# EAGLE schematic arduino-configuration-shield (EAGLE 6.5.0)
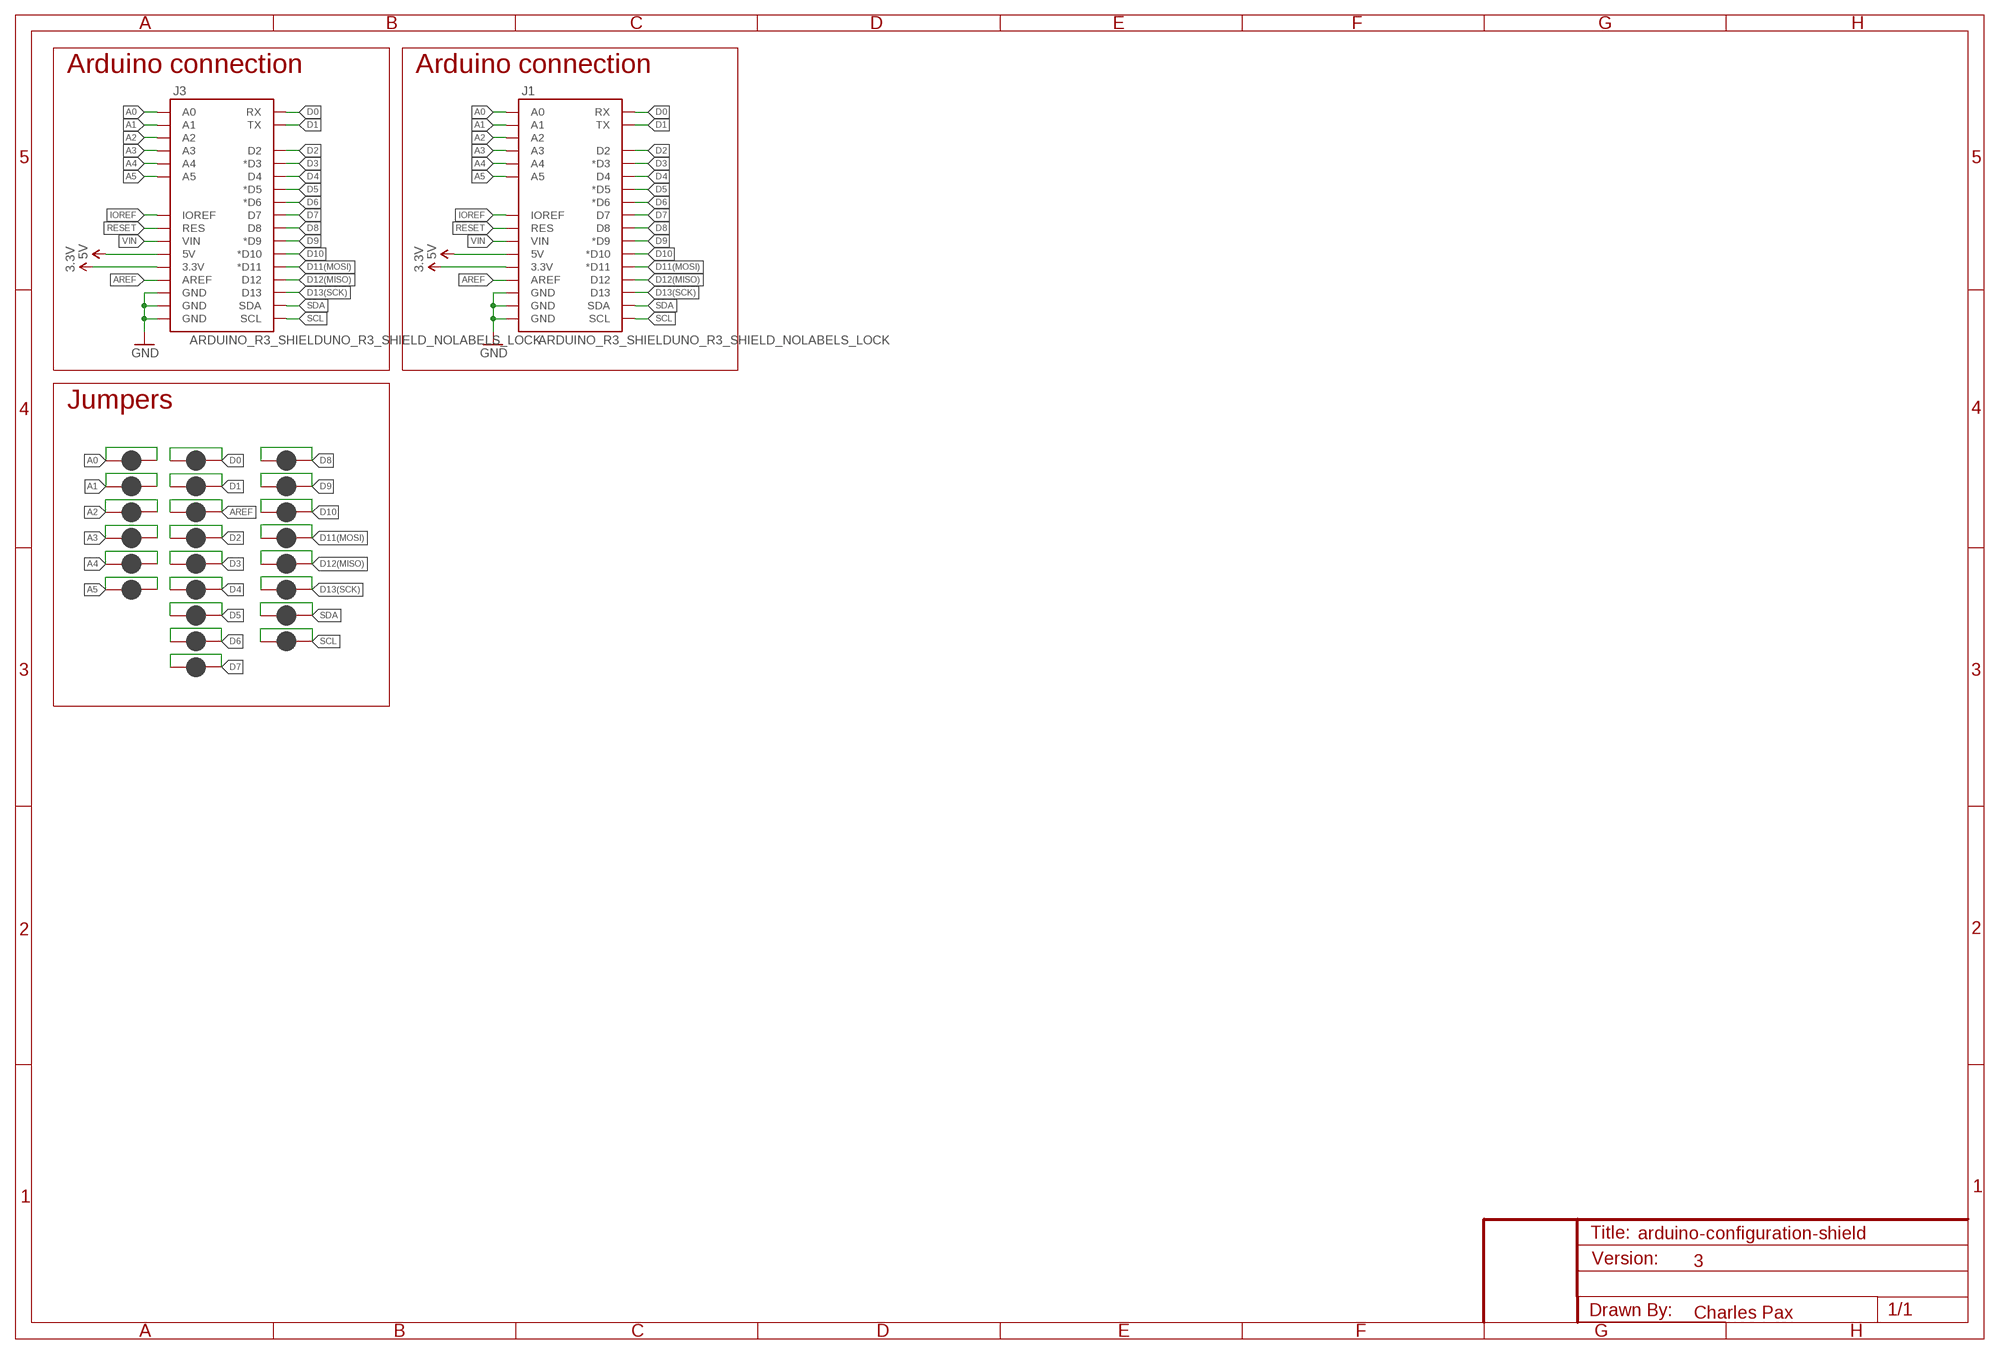
[diagram p0: schematic, sheet 1]

## Parts
J1  ARDUINO_R3_SHIELDUNO_R3_SHIELD_NOLABELS_LOCK  [UNO_R3_SHIELD_NOLABELS_LOCK]
J3  ARDUINO_R3_SHIELDUNO_R3_SHIELD_NOLABELS_LOCK  [UNO_R3_SHIELD_NOLABELS_LOCK]
SJ1  JUMPER-PAD-2-NC_BY_PASTE  [PAD-JUMPER-2-NC_BY_PASTE_YES_SILK]
SJ2  JUMPER-PAD-2-NC_BY_PASTE  [PAD-JUMPER-2-NC_BY_PASTE_YES_SILK]
SJ3  JUMPER-PAD-2-NC_BY_PASTE  [PAD-JUMPER-2-NC_BY_PASTE_YES_SILK]
SJ4  JUMPER-PAD-2-NC_BY_PASTE  [PAD-JUMPER-2-NC_BY_PASTE_YES_SILK]
SJ5  JUMPER-PAD-2-NC_BY_PASTE  [PAD-JUMPER-2-NC_BY_PASTE_YES_SILK]
SJ6  JUMPER-PAD-2-NC_BY_PASTE  [PAD-JUMPER-2-NC_BY_PASTE_YES_SILK]
SJ7  JUMPER-PAD-2-NC_BY_PASTE  [PAD-JUMPER-2-NC_BY_PASTE_YES_SILK]
SJ8  JUMPER-PAD-2-NC_BY_PASTE  [PAD-JUMPER-2-NC_BY_PASTE_YES_SILK]
SJ9  JUMPER-PAD-2-NC_BY_PASTE  [PAD-JUMPER-2-NC_BY_PASTE_YES_SILK]
SJ10  JUMPER-PAD-2-NC_BY_PASTE  [PAD-JUMPER-2-NC_BY_PASTE_YES_SILK]
SJ11  JUMPER-PAD-2-NC_BY_PASTE  [PAD-JUMPER-2-NC_BY_PASTE_YES_SILK]
SJ12  JUMPER-PAD-2-NC_BY_PASTE  [PAD-JUMPER-2-NC_BY_PASTE_YES_SILK]
SJ13  JUMPER-PAD-2-NC_BY_PASTE  [PAD-JUMPER-2-NC_BY_PASTE_YES_SILK]
SJ14  JUMPER-PAD-2-NC_BY_PASTE  [PAD-JUMPER-2-NC_BY_PASTE_YES_SILK]
SJ15  JUMPER-PAD-2-NC_BY_PASTE  [PAD-JUMPER-2-NC_BY_PASTE_YES_SILK]
SJ19  JUMPER-PAD-2-NC_BY_PASTE  [PAD-JUMPER-2-NC_BY_PASTE_YES_SILK]
SJ20  JUMPER-PAD-2-NC_BY_PASTE  [PAD-JUMPER-2-NC_BY_PASTE_YES_SILK]
SJ21  JUMPER-PAD-2-NC_BY_PASTE  [PAD-JUMPER-2-NC_BY_PASTE_YES_SILK]
SJ22  JUMPER-PAD-2-NC_BY_PASTE  [PAD-JUMPER-2-NC_BY_PASTE_YES_SILK]
SJ23  JUMPER-PAD-2-NC_BY_PASTE  [PAD-JUMPER-2-NC_BY_PASTE_YES_SILK]
SJ24  JUMPER-PAD-2-NC_BY_PASTE  [PAD-JUMPER-2-NC_BY_PASTE_YES_SILK]
SJ25  JUMPER-PAD-2-NC_BY_PASTE  [PAD-JUMPER-2-NC_BY_PASTE_YES_SILK]
SJ26  JUMPER-PAD-2-NC_BY_PASTE  [PAD-JUMPER-2-NC_BY_PASTE_YES_SILK]

## Nets
3.3V: J1.3.3V J3.3.3V
5V: J1.5V J3.5V
A0: J1.A0 J3.A0 SJ10.1 SJ10.2
A1: J1.A1 J3.A1 SJ7.1 SJ7.2
A2: J1.A2 J3.A2 SJ11.1 SJ11.2
A3: J1.A3 J3.A3 SJ12.1 SJ12.2
A4: J1.A4 J3.A4 SJ13.1 SJ13.2
A5: J1.A5 J3.A5 SJ14.1 SJ14.2
AREF: J1.AREF J3.AREF SJ15.1 SJ15.2
D0: J1.RX J3.RX SJ8.1 SJ8.2
D1: J1.TX J3.TX SJ9.1 SJ9.2
D2: J1.D2 J3.D2 SJ3.1 SJ3.2
D3: J1.D3(*D3) J3.D3(*D3) SJ4.1 SJ4.2
D4: J1.D4 J3.D4 SJ5.1 SJ5.2
D5: J1.D5(*D5) J3.D5(*D5) SJ6.1 SJ6.2
D6: J1.D6(*D6) J3.D6(*D6) SJ19.1 SJ19.2
D7: J1.D7 J3.D7 SJ20.1 SJ20.2
D8: J1.D8 J3.D8 SJ21.1 SJ21.2
D9: J1.D9(*D9) J3.D9(*D9) SJ22.1 SJ22.2
D10: J1.D10(*D10) J3.D10(*D10) SJ23.1 SJ23.2
D11(MOSI): J1.D11(*D11) J3.D11(*D11) SJ24.1 SJ24.2
D12(MISO): J1.D12 J3.D12 SJ25.1 SJ25.2
D13(SCK): J1.D13 J3.D13 SJ26.1 SJ26.2
GND: J1.GND@0(GND) J1.GND@1(GND) J1.GND@2(GND) J3.GND@0(GND) J3.GND@1(GND) J3.GND@2(GND)
IOREF: J1.IOREF J3.IOREF
RESET: J1.RES J3.RES
SCL: J1.SCL J3.SCL SJ2.1 SJ2.2
SDA: J1.SDA J3.SDA SJ1.1 SJ1.2
VIN: J1.VIN J3.VIN

## Notes on the sheet
- Arduino connection | Arduino connection
- Jumpers
- 3
- Charles Pax

## Library data of the parts
J1 J3 = SparkFun-Boards:ARDUINO_R3_SHIELD: Shield form compatible with the Arduino Uno R3.
SJ1-SJ15 SJ19-SJ26 = SparkFun-Passives:JUMPER-PAD-2-NC_BY_PASTE

## Net classes
0 default: width 0.203 mm, drill 0.33 mm
1 power: width 0.305 mm